# EAGLE design 514_lora_arduino_RAK811 (EAGLE 9.6.2)
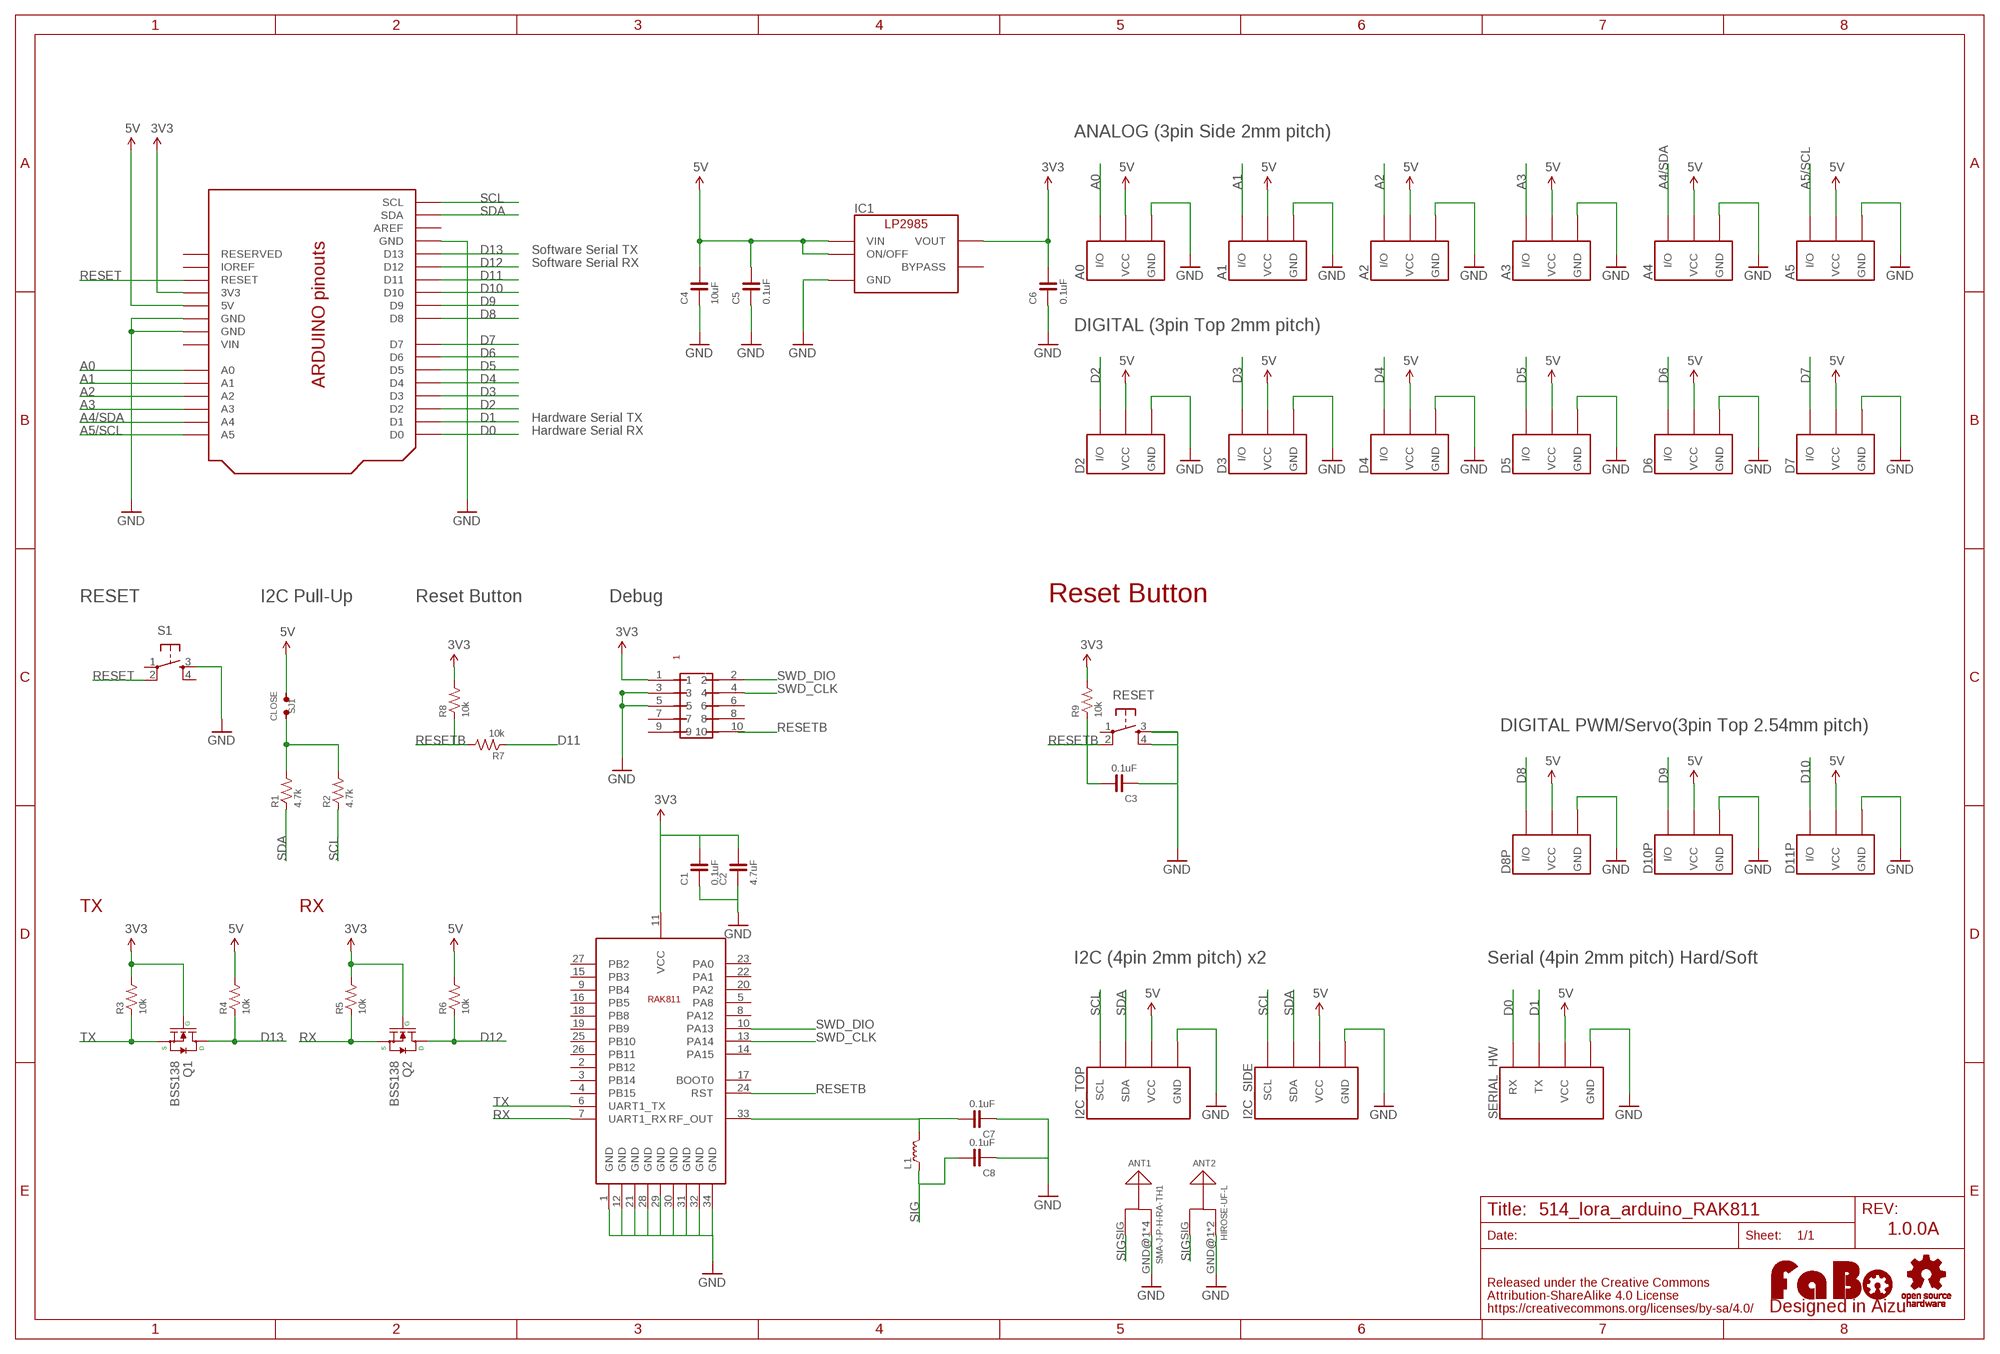
[diagram p0: schematic, sheet 1]

## Parts
A0  FABO_BRICK_3PIN-S03B-PASK-2_LONG  [FABO_BRICK_3PIN_S03B-PASK-2_LONG]
A1  FABO_BRICK_3PIN-S03B-PASK-2_LONG  [FABO_BRICK_3PIN_S03B-PASK-2_LONG]
A2  FABO_BRICK_3PIN-S03B-PASK-2_LONG  [FABO_BRICK_3PIN_S03B-PASK-2_LONG]
A3  FABO_BRICK_3PIN-S03B-PASK-2_LONG  [FABO_BRICK_3PIN_S03B-PASK-2_LONG]
A4  FABO_BRICK_3PIN-S03B-PASK-2_LONG  [FABO_BRICK_3PIN_S03B-PASK-2_LONG]
A5  FABO_BRICK_3PIN-S03B-PASK-2_LONG  [FABO_BRICK_3PIN_S03B-PASK-2_LONG]
ANT1  SMA-J-P-H-RA-TH1  ANTENA_SMA-J-P-H-RA-TH1  [SMA–J–P–H–RA–TH1]
ANT2  HIROSE-UF-L  ANTENA_HIROSE-UF-L  [HIROSE-UF-L]
C1  0.1uF  CAPACITOR-0603_NARROW  [0603-NARROW]
C2  4.7uF  CAPACITOR-0603_NARROW  [0603-NARROW]
C3  0.1uF  CAPACITOR-0603_NARROW  [0603-NARROW]
C4  10uF  CAPACITOR-0603_NARROW  [0603-NARROW]
C5  0.1uF  CAPACITOR-0603_NARROW  [0603-NARROW]
C6  0.1uF  CAPACITOR-0603_NARROW  [0603-NARROW]
C7  0.1uF  CAPACITOR-0603_NARROW  [0603-NARROW]
C8  0.1uF  CAPACITOR-0603_NARROW  [0603-NARROW]
D2  FABO_BRICK_3PIN-B03B-PASK-1  [FABO_BRICK_3PIN_B03B-PASK-1]
D3  FABO_BRICK_3PIN-B03B-PASK-1  [FABO_BRICK_3PIN_B03B-PASK-1]
D4  FABO_BRICK_3PIN-B03B-PASK-1  [FABO_BRICK_3PIN_B03B-PASK-1]
D5  FABO_BRICK_3PIN-B03B-PASK-1  [FABO_BRICK_3PIN_B03B-PASK-1]
D6  FABO_BRICK_3PIN-B03B-PASK-1  [FABO_BRICK_3PIN_B03B-PASK-1]
D7  FABO_BRICK_3PIN-B03B-PASK-1  [FABO_BRICK_3PIN_B03B-PASK-1]
D8P  FABO_BRICK_3PIN-HEADER  [FABO_BRICK_3PIN_HEADER]
D10P  FABO_BRICK_3PIN-HEADER  [FABO_BRICK_3PIN_HEADER]
D11P  FABO_BRICK_3PIN-HEADER  [FABO_BRICK_3PIN_HEADER]
I2C_SIDE  FABO_BRICK_I2C-S04B-PASK-2_LONG  [FABO_BRICK_I2C_S04B-PASK-2_LONG]
I2C_TOP  FABO_BRICK_I2C-B04B-PASK-1  [FABO_BRICK_I2C_B04B-PASK-1]
IC1  LP2985-33DBV  [SOT-23-5]
L1  COIL-0603  [0603]
LOGO1  LOGO_FABO-M  [LOGO_FABO_M]
Q1  BSS138  MOSFET-N  [SOT23-3]
Q2  BSS138  MOSFET-N  [SOT23-3]
R1  4.7k  RESISTOR-0603  [0603]
R2  4.7k  RESISTOR-0603  [0603]
R3  10k  RESISTOR-0603-NARROW  [0603-NARROW]
R4  10k  RESISTOR-0603-NARROW  [0603-NARROW]
R5  10k  RESISTOR-0603-NARROW  [0603-NARROW]
R6  10k  RESISTOR-0603-NARROW  [0603-NARROW]
R7  10k  RESISTOR-0603-NARROW  [0603-NARROW]
R8  10k  RESISTOR-0603-NARROW  [0603-NARROW]
R9  10k  RESISTOR-0603-NARROW  [0603-NARROW]
RESET  TACT-SWITCH-SMD_KMR2  [KMR2]
S1  TACT-SWITCH-6MM  [DTS_6_V]
SERIAL_HW  FABO_BRICK_SERIAL-B04B-PASK-1  [FABO_BRICK_SERIAL_B04B-PASK-1]
SJ1  CLOSE  SMD-JUMPER-2-0603  [SMD-JUMPER-0603]
U1  ARDUINO_UNO_R3_SHIELD-OUTIN  [ARDUINO_SHIELD_OUTIN]
U$3  RAK811  [RAK811]
U$4  LOGO_OSHW-M_BOTTOM  [LOGO_OSHW_M_BOTTOM]
U$15  PIN-HEADER-SMT(1.27MM)2X5  [PIN-HEADER-SMT(1.27MM)2X5]

## Nets
3V3: C1.2 C2.2 C6.2 IC1.5(VOUT) Q1.1(G) Q2.1(G) R3.2 R5.2 R8.2 R9.2 U1.3V3 U$3.11(VCC) U$15.1
5V: A0.VCC A1.VCC A2.VCC A3.VCC A4.VCC A5.VCC C4.2 C5.2 D2.VCC D3.VCC D4.VCC D5.VCC D6.VCC D7.VCC D8P.VCC D10P.VCC D11P.VCC I2C_SIDE.VCC I2C_TOP.VCC IC1.1(VIN) IC1.3(ON/OFF) R4.2 R6.2 SERIAL_HW.VCC SJ1.1 U1.5V
A0: A0.I/O U1.A0
A1: A1.I/O U1.A1
A2: A2.I/O U1.A2
A3: A3.I/O U1.A3
A4/SDA: A4.I/O U1.A4
A5/SCL: A5.I/O U1.A5
D0: SERIAL_HW.RX U1.D0
D1: SERIAL_HW.TX U1.D1
D2: D2.I/O U1.D2
D3: D3.I/O U1.D3
D4: D4.I/O U1.D4
D5: D5.I/O U1.D5
D6: D6.I/O U1.D6
D7: D7.I/O U1.D7
D8: D8P.I/O U1.D8
D9: D10P.I/O U1.D9
D10: D11P.I/O U1.D10
D11: R7.1 U1.D11
D12: Q2.3(D) R6.1 U1.D12
D13: Q1.3(D) R4.1 U1.D13
GND: A0.GND A1.GND A2.GND A3.GND A4.GND A5.GND ANT1.GND@1(GND) ANT1.GND@2(GND) ANT1.GND@3(GND) ANT1.GND@4(GND) ANT2.GND@1(GND) ANT2.GND@2(GND) C1.1 C2.1 C3.1 C4.1 C5.1 C6.1 C7.1 C8.1 D2.GND D3.GND D4.GND D5.GND D6.GND D7.GND D8P.GND D10P.GND D11P.GND I2C_SIDE.GND I2C_TOP.GND IC1.2(GND) RESET.3 RESET.4 S1.3 SERIAL_HW.GND U1.GND1(GND) U1.GND2(GND) U1.GND3(GND) U$3.1(GND) U$3.12(GND) U$3.21(GND) U$3.28(GND) U$3.30(GND) U$3.31(GND) U$3.32(GND) U$3.34(GND) U$15.3 U$15.5
N$1: R1.2 R2.2 SJ1.2
N$2: C7.2 L1.2 U$3.33(RF_OUT)
RESET: S1.2 U1.RESET
RESETB: C3.2 R7.2 R8.1 R9.1 RESET.2 U$3.24(RST) U$15.10
RX: Q2.2(S) R5.1 U$3.7(UART1_RX)
SCL: I2C_SIDE.SCL I2C_TOP.SCL R2.1 U1.SCL
SDA: I2C_SIDE.SDA I2C_TOP.SDA R1.1 U1.SDA
SIG: ANT1.SIG ANT2.SIG C8.2 L1.1
SWD_CLK: U$3.13(PA14) U$15.4
SWD_DIO: U$3.10(PA13) U$15.2
TX: Q1.2(S) R3.1 U$3.6(UART1_TX)
Unconnected: IC1.4(BYPASS) RESET.1 S1.1 S1.4 U1.AREF U1.IOREF U1.RESERVED U$3.2(PB12) U$3.3(PB14) U$3.4(PB15) U$3.5(PA8) U$3.8(PA12) U$3.9(PB4) U$3.14(PA15) U$3.15(PB3) U$3.16(PB5) U$3.17(BOOT0) U$3.18(PB8) U$3.19(PB9) U$3.20(PA2) U$3.22(PA1) U$3.23(PA0) U$3.25(PB10) U$3.26(PB11) U$3.27(PB2) U$3.29(GND) U$15.6 U$15.7 U$15.8 U$15.9

## Notes on the sheet
- ANALOG (3pin Side 2mm pitch)
- Software Serial TX
- Software Serial RX
- DIGITAL (3pin Top 2mm pitch)
- Hardware Serial TX
- Hardware Serial RX
- RESET | I2C Pull-Up | Reset Button | Debug | Reset Button
- DIGITAL PWM/Servo(3pin Top 2.54mm pitch)
- TX | RX
- I2C (4pin 2mm pitch) x2 | Serial (4pin 2mm pitch) Hard/Soft
- 1.0.0A

## Power pins joined to a net without a drawn wire
VIN: U1.VIN

## Library data of the parts
A0 A1-A5 D2-D7 D8P D10P D11P = FaBo-Template:FABO_BRICK_3PIN: FaBo Brick 3pin
ANT1 ANT2 = FaBo-Antena:ANTENA
C1-C8 = FaBo-Capacitor:CAPACITOR: CAPACITOR
I2C_SIDE I2C_TOP = FaBo-Template:FABO_BRICK_I2C: FaBo Brick I2C
IC1 = FaBo-Supply:LP2985: LP2985
L1 = FaBo-Coil:COIL: RESISTOR
LOGO1 = component:LOGO_FABO
Q1 Q2 = FaBo-etc:MOSFET-N
R1-R9 = FaBo-Resistors:RESISTOR: RESISTOR
RESET S1 = FaBo-Switch:TACT-SWITCH
SERIAL_HW = FaBo-Template:FABO_BRICK_SERIAL: FaBo Brick Serial
SJ1 = FaBo-Supply:SMD-JUMPER-2
U1 = FaBo-Boards:ARDUINO_UNO_R3_SHIELD
U$3 = FaBo-LoRa:RAK811
U$4 = component:LOGO_OSHW
U$15 = GClue:PIN-HEADER-SMT(1.27MM)2X5: PIN-HEADER-SMT (1.27MM) 2x5

## Board
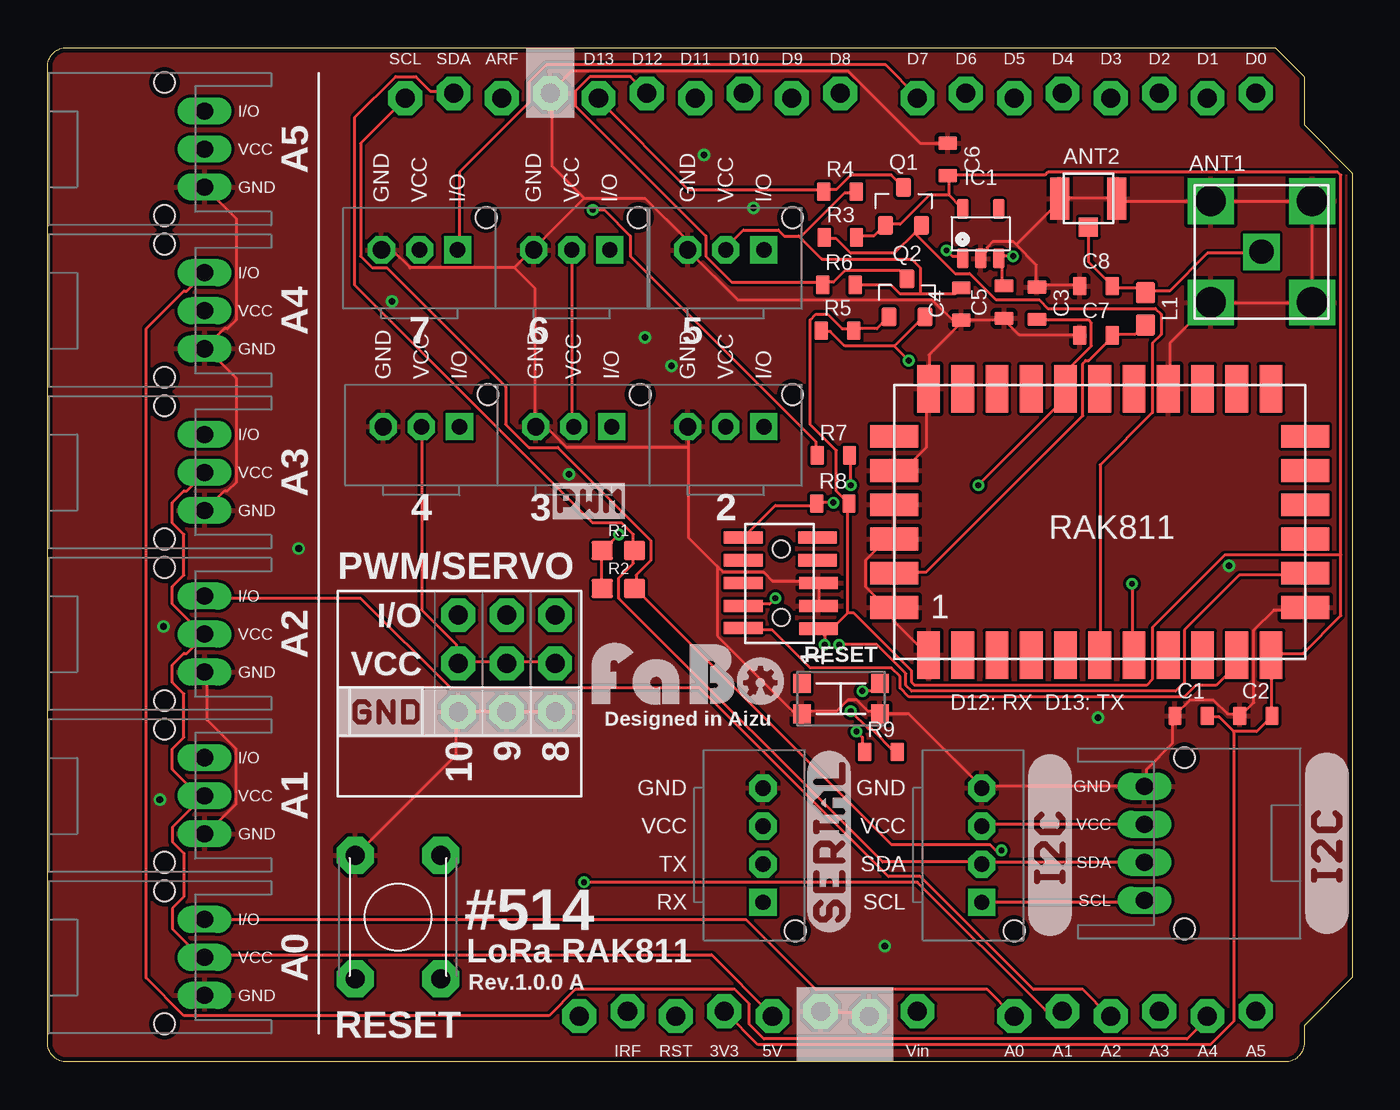
[diagram p1: board, top side]
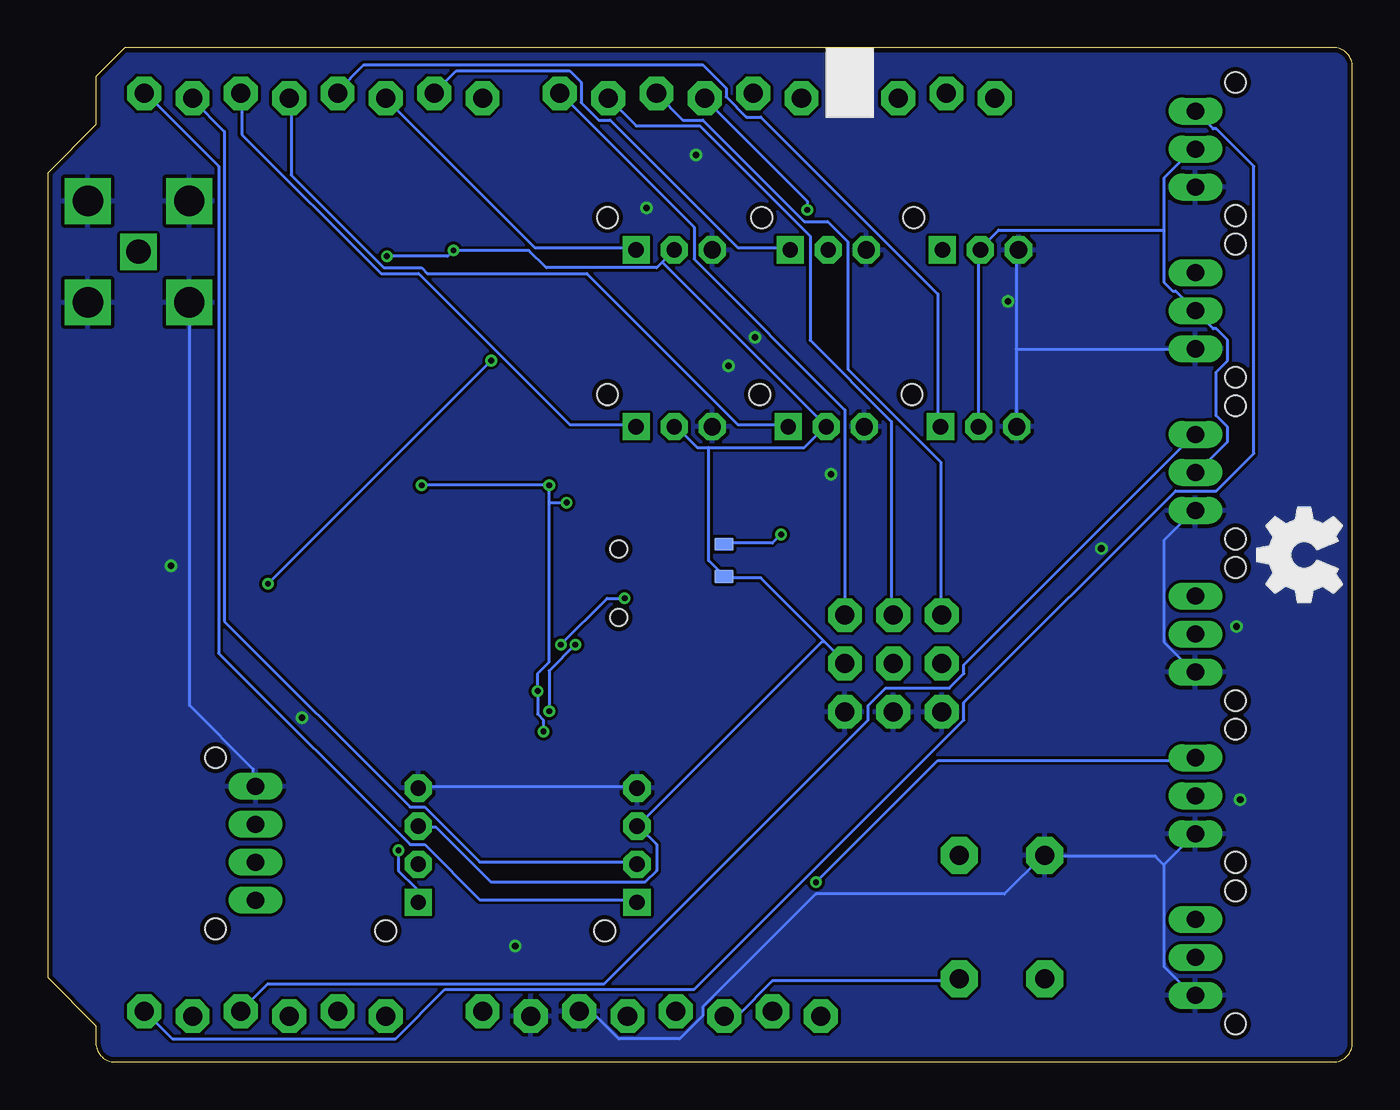
[diagram p2: board, bottom side, seen from below]

Size 68.58 x 53.34 mm. Coordinates in mm from the lower left corner, seen from the top.
Copper layers (1*16): Top 0.035mm / dielectric 1.6mm / Bottom 0.035mm
Design rules "PCBway": minimum track width 6mil, minimum drill 12mil, track to track 6mil, track to pad 6mil, pad to pad 6mil, via to via 6mil, smd to smd 6mil, copper to edge 10mil, drill to drill 10mil, minimum pad ring 10mil, minimum via ring 6mil, stop-mask expansion 2mil, vias tented up to drill 100mil, thermal gap 8mil

### Footprints (pad centres in the part's own frame; a part is rotated, then mirrored left to right if it is on the bottom)
FABO_BRICK_3PIN_S03B-PASK-2_LONG = drill 0.9 pad 1.422 long: GND -2,0; I/O 2,0; VCC 0,0 | hole 1.1: 3.5,2.1; -3.5,2.1
SMA–J–P–H–RA–TH1 = drill 1.6 square: GND@1 -2.665,2.665; GND@2 2.665,2.665; GND@3 -2.665,-2.665; GND@4 2.665,-2.665 | drill 1.27 square: SIG 0,0
HIROSE-UF-L = smd 1 x 2.2: GND@1 -1.5,0; GND@2 1.5,0 | smd 1 x 1: SIG 0,-1.5
0603-NARROW = smd 0.71 x 1: 1 -0.85,0; 2 0.85,0
FABO_BRICK_3PIN_B03B-PASK-1 = drill 0.9 pad 1.422 octagon: GND -2,0 | drill 0.8 pad 1.422 square: I/O 2,0 | drill 0.8 pad 1.422 octagon: VCC 0,0 | hole 1.1: 3.5,1.7
FABO_BRICK_3PIN_HEADER = drill 1 pad 1.778 octagon: GND -2.54,0; I/O 2.54,0; VCC 0,0
FABO_BRICK_I2C_S04B-PASK-2_LONG = drill 0.9 pad 1.422 long: GND -3,0; SCL 3,0; SDA 1,0; VCC -1,0 | hole 1.1: 4.5,2.1; -4.5,2.1
FABO_BRICK_I2C_B04B-PASK-1 = drill 0.8 pad 1.422 octagon: GND -3,0; SDA 1,0; VCC -1,0 | drill 0.8 pad 1.422 square: SCL 3,0 | hole 1.1: 4.5,1.7
SOT-23-5 = smd 0.6 x 1.05: 1 -0.95,-1.3; 2 0,-1.3; 3 0.95,-1.3; 4 0.95,1.3; 5 -0.95,1.3
0603 = smd 1.1 x 1: 1 -0.85,0; 2 0.85,0
SOT23-3 = smd 0.8 x 1: 1 -0.95,-1; 2 0.95,-1; 3 0,1
KMR2 = smd 0.9 x 1: 1 -2.05,0.8; 2 2.05,0.8; 3 2.05,-0.8; 4 -2.05,-0.8
DTS_6_V = drill 1 pad 1.93 octagon: 1 -3.25,2.25; 2 3.25,2.25; 3 -3.25,-2.25; 4 3.25,-2.25
FABO_BRICK_SERIAL_B04B-PASK-1 = drill 0.8 pad 1.422 octagon: GND -3,0; TX 1,0; VCC -1,0 | drill 0.8 pad 1.422 square: RX 3,0 | hole 1.1: 4.5,1.7
SMD-JUMPER-0603 = smd 0.71 x 1: 1 -0.85,0; 2 0.85,0
ARDUINO_SHIELD_OUTIN = drill 1 pad 1.778 octagon: 3V3 35.56,2.667; 5V 38.1,2.413; A0 50.8,2.413; A1 53.34,2.667; A2 55.88,2.413; A3 58.42,2.667; A4 60.96,2.413; A5 63.5,2.667; AREF 23.876,50.673; D0 63.5,50.927; D1 60.96,50.673; D2 58.42,50.927; D3 55.88,50.673; D4 53.34,50.927; D5 50.8,50.673; D6 48.26,50.927; D7 45.72,50.673; D8 41.656,50.927; D9 39.116,50.673; D10 36.576,50.927; D11 34.036,50.673; D12 31.496,50.927; D13 28.956,50.673; GND1 43.18,2.413; GND2 40.64,2.667; GND3 26.416,50.927; IOREF 30.48,2.667; RESERVED 27.94,2.413; RESET 33.02,2.413; SCL 18.796,50.673; SDA 21.336,50.927; VIN 45.72,2.667
RAK811 = smd 1.2 x 2.5: 1 -9,-7; 2 -7.2,-7; 3 -5.4,-7; 4 -3.6,-7; 5 -1.8,-7; 6 0,-7; 7 1.8,-7; 8 3.6,-7; 9 5.4,-7; 10 7.2,-7; 11 9,-7; 18 9,7; 19 7.2,7; 20 5.4,7; 21 3.6,7; 22 1.8,7; 23 0,7; 24 -1.8,7; 25 -3.6,7; 26 -5.4,7; 27 -7.2,7; 28 -9,7 | smd 2.5 x 1.2: 12 10.8,-4.5; 13 10.8,-2.7; 14 10.8,-0.9; 15 10.8,0.9; 16 10.8,2.7; 17 10.8,4.5; 29 -10.8,4.5; 30 -10.8,2.7; 31 -10.8,0.9; 32 -10.8,-0.9; 33 -10.8,-2.7; 34 -10.8,-4.5
PIN-HEADER-SMT(1.27MM)2X5 = smd 0.635 x 2.032: 1 -2.4,-1.95; 2 -2.35,2; 3 -1.2,-1.95; 4 -1.2,2; 5 0,-1.95; 6 0,2; 7 1.2,-1.9; 8 1.2,2; 9 2.4,-1.9; 10 2.4,2 | hole 0.9: 1.8,0; -1.8,0

### Placement (x,y rotation side)
A0  8.25,5.5 90 top
A1  8.25,14 90 top
A2  8.25,22.5 90 top
A3  8.25,31 90 top
A4  8.25,39.5 90 top
A5  8.25,48 90 top
ANT1  63.8,42.6 0 top
ANT2  54.7,45.4 0 top
C1  60.1,18.2 0 top
C2  63.5,18.2 0 top
C3  52,39.9 270 top
C4  48.02,39.85 90 top
C5  50.27,39.95 90 top
C6  47.31,47.45 270 top
C7  55.1,38.2 0 top
C8  55.1,40.8 0 top
D2  35.65,33.4 0 top
D3  27.65,33.4 0 top
D4  19.65,33.4 0 top
D5  35.65,42.7 0 top
D6  27.55,42.7 0 top
D7  19.55,42.7 0 top
D8P  26.67,20.95 90 top
D10P  24.13,20.95 90 top
D11P  21.59,20.95 90 top
I2C_SIDE  57.65,11.5 270 top
I2C_TOP  49.1,11.4 270 top
IC1  49.04,43.55 0 top
L1  57.7,39.6 270 top
LOGO1  33.66,18.41 0 top
Q1  44.98,44.98 0 top
Q2  45.16,40.19 0 top
R1  30,26.9 180 top
R2  30,24.9 180 top
R3  41.67,43.36 0 top
R4  41.65,45.76 0 top
R5  41.52,38.46 0 top
R6  41.59,40.86 0 top
R7  41.3,31.9 0 top
R8  41.27,29.36 0 top
R9  43.8,16.3 0 top
RESET  41.7,19.1 0 top
S1  18.41,7.62 270 top
SERIAL_HW  37.6,11.4 270 top
SJ1  33.03,26.37 90 bottom
U1  0,0 0 top
U$2  [LOGO_SILK_SERIAL2]  42.25,11.6 90 top
U$3  55.3,28.4 0 top
U$4  2.54,26.67 270 top
U$5  [LOGO_SILK_PWM]  26.55,28.55 0 top
U$11  [LOGO_SILK_I2C]  68.4,11.5 90 top
U$12  [LOGO_SILK_I2C]  53.85,11.4 90 top
U$15  38.56,25.18 90 top
U$19  [LOGO_SILK_GND]  15.88,17.14 0 top

### Tracks (layer width: path | path; a pad name or v marks a point on that pad's centre or on a via)
3V3  (via drill 0.3)
  Top 0.152: Q2.1 44.2,39.17 43.59,38.56 42.52,38.56 R5.2 42.37,38.56 41.76,38.56 41,39.32 40.39,39.32 40.08,39.01 40.08,33.53 41.45,32.16 41.45,30.02 42.06,29.41 R8.2 42.06,29.26 42.06,23.62 | v42.22,18.44 43.13,17.53 43.28,17.53 44.5,16.31 R9.2 | 40.84,22.4 v40.84,21.95 | 40.84,22.4 40.54,22.71 U$15.1 | 40.84,22.4 42.06,23.62 | R3.2 42.67,43.43 43.43,43.43 43.89,43.89 Q1.1 44.04,44.04 44.81,44.04 46.33,45.57 47.4,45.57 | 47.4,45.57 47.4,46.48 C6.2 47.4,46.63 52.43,46.63 52.58,46.79 67.82,46.79 67.97,46.63 67.97,26.67 | 47.4,45.57 48.01,44.96 IC1.5 | 62.33,17.37 61.57,18.14 60.96,18.14 C1.2 | 62.33,17.37 63.55,17.37 64.31,18.14 C2.2 64.31,18.29 64.31,21.34 U$3.11 64.31,21.49 65.99,21.49 67.97,23.47 67.97,26.67 | 62.33,17.37 62.33,2.13 61.11,0.91 37.34,0.91 35.66,2.59 U1.3V3 | 42.06,23.62 42.37,23.62 45.41,20.57 45.41,19.96 45.57,19.81 57.76,19.81 58.06,20.12 58.06,22.86 61.87,26.67 67.97,26.67
  Bottom 0.152: v42.22,18.44 42.22,20.57 v40.84,21.95
5V  (via drill 0.3)
  Top 0.152: 45.87,40.39 47.7,40.39 48.01,40.69 C4.2 | 45.87,40.39 44.81,40.39 44.35,40.84 42.52,40.84 R6.2 | C5.2 50.14,40.84 50.14,42.22 IC1.3 50.14,42.37 v50.75,42.37 | 39.47,43.43 38.71,43.43 38.41,43.74 36.58,43.74 35.66,42.82 D5.VCC | 39.47,43.43 39.62,43.43 41.91,45.72 42.37,45.72 R4.2 | v47.24,42.67 47.55,42.37 48.01,42.37 IC1.1 | 45.87,40.39 45.87,41.76 45.41,42.22 40.69,42.22 39.47,43.43 | D6.VCC 27.58,42.67 27.58,33.53 D3.VCC | I2C_TOP.VCC 49.23,12.5 57.61,12.5 I2C_SIDE.VCC | D8P.VCC 26.67,21.03 24.23,21.03 D10P.VCC 24.08,21.03 21.64,21.03 D11P.VCC 21.49,21.03 21.49,21.95 19.66,23.77 19.66,33.38 D4.VCC | 8.08,13.87 8.23,14.02 A1.VCC 8.08,13.87 | 8.08,13.87 6.55,12.34 6.55,11.58 7.16,10.97 7.16,8.69 6.55,8.08 6.55,7.01 7.92,5.64 8.23,5.64 A0.VCC 8.38,5.64 34.9,5.64 38.1,2.44 U1.5V | 8.23,22.4 7.32,21.49 7.16,21.49 6.55,20.88 6.55,19.96 7.16,19.36 7.16,17.07 6.55,16.46 6.55,15.39 8.08,13.87 | 8.23,22.4 6.55,24.08 6.55,24.99 7.16,25.6 7.16,27.74 6.55,28.35 6.55,29.41 7.16,30.02 7.32,30.02 8.23,30.94 A3.VCC | 8.23,22.4 A2.VCC
  Bottom 0.152: 36.27,42.06 35.66,42.67 D5.VCC | 36.27,42.06 36.58,41.76 42.37,41.76 43.28,42.67 v47.24,42.67 47.55,42.37 v50.75,42.37 | 33.83,32.31 34.44,32.31 35.51,33.38 D2.VCC | 33.83,32.31 28.8,32.31 27.74,33.38 D3.VCC 27.74,33.53 36.27,42.06 | 27.74,22.1 26.67,21.03 D8P.VCC | 27.74,22.1 31.09,25.45 32.92,25.45 SJ1.1 33.07,25.6 33.83,26.36 33.83,32.31 | 27.74,22.1 27.89,22.1 37.49,12.5 SERIAL_HW.VCC 37.49,12.34 36.58,11.43 36.58,10.06 37.19,9.45 45.26,9.45 48.16,12.34 49.07,12.34 I2C_TOP.VCC | 9.91,43.74 9.91,46.48 8.38,48.01 A5.VCC | 9.91,43.74 9.91,41 9.45,40.54 9.3,40.54 8.38,39.62 A4.VCC 8.23,39.47 7.32,38.56 7.16,38.56 6.55,37.95 6.55,36.88 7.16,36.27 7.16,33.98 6.55,33.38 6.55,32.61 8.23,30.94 A3.VCC | D4.VCC 19.66,33.53 19.66,42.67 D7.VCC 19.51,42.82 18.59,43.74 9.91,43.74
A0
  Top 0.152: A0.I/O 8.38,7.47 36.73,7.47 40.39,3.81 49.38,3.81 50.75,2.44 U1.A0
A1  (via drill 0.3)
  Top 0.152: v28.19,9.45 45.72,9.45 52.43,2.74 53.34,2.74 U1.A1
  Bottom 0.152: v28.19,9.45 21.79,15.85 8.38,15.85 A1.I/O
A2
  Top 0.152: A2.I/O 8.38,24.38 16.46,24.38 21.18,19.66 34.29,19.66 44.2,9.75 45.87,9.75 51.82,3.81 54.41,3.81 55.78,2.44 U1.A2
A3
  Bottom 0.152: A3.I/O 8.38,32.92 20.42,20.88 20.42,20.42 21.18,19.66 24.54,19.66 25.45,18.75 25.45,17.98 39.32,4.12 57,4.12 58.37,2.74 U1.A3
A4/SDA
  Top 0.152: A4.I/O 8.23,41.45 7.32,40.54 7.16,40.54 5.18,38.56 5.18,4.42 7.16,2.44 26.36,2.44 27.74,3.81 36.12,3.81 36.88,3.05 36.88,1.98 37.64,1.22 59.89,1.22 60.96,2.29 U1.A4
A5/SCL
  Bottom 0.152: A5.I/O 8.23,49.99 7.32,49.07 7.16,49.07 5.18,47.09 5.18,32 7.16,30.02 9.3,30.02 20.42,18.9 20.42,17.98 34.59,3.81 47.7,3.81 50.29,1.22 62.03,1.22 63.4,2.59 U1.A5
D0
  Bottom 0.152: SERIAL_HW.RX 37.64,8.53 45.87,8.53 48.77,11.43 49.53,11.43 59.59,21.49 59.59,47.09 63.4,50.9 U1.D0
D1
  Bottom 0.152: SERIAL_HW.TX 37.64,10.52 45.87,10.52 48.77,13.41 49.53,13.41 59.28,23.16 59.28,48.92 60.96,50.6 U1.D1
D2
  Bottom 0.152: D2.I/O 37.8,33.53 41.15,33.53 49.07,41.45 51.05,41.45 58.37,48.77 58.37,50.9 U1.D2
D3
  Bottom 0.152: D3.I/O 29.72,33.53 32.31,33.53 40.23,41.45 48.62,41.45 48.92,41.76 50.9,41.76 55.78,46.63 55.78,50.6 U1.D3
D4
  Bottom 0.152: D4.I/O 21.79,33.53 21.79,40.39 31.09,49.68 31.85,49.68 32.92,50.75 32.92,51.21 34.14,52.43 51.97,52.43 53.34,51.05 U1.D4
D5
  Bottom 0.152: D5.I/O 37.8,42.82 42.98,42.82 50.75,50.6 U1.D5
D6
  Bottom 0.152: D6.I/O 29.57,42.82 32.31,42.82 39.01,49.53 39.62,49.53 40.54,50.44 40.54,51.51 41.15,52.12 47.09,52.12 48.16,51.05 U1.D6
D7
  Top 0.152: D7.I/O 21.64,42.82 21.64,46.79 25.3,50.44 25.3,51.51 26.21,52.43 44.04,52.43 45.72,50.75 U1.D7
D8
  Bottom 0.152: D8P.I/O 26.67,34.29 34.59,42.22 34.59,43.89 41.6,50.9 U1.D8
D9
  Bottom 0.152: D10P.I/O 24.23,23.62 24.23,33.68 28.5,37.95 28.5,43.43 34.29,49.23 37.64,49.23 39.01,50.6 U1.D9
D10
  Bottom 0.152: D11P.I/O 21.64,23.62 21.64,31.55 26.52,36.42 26.52,43.13 27.58,44.2 28.8,44.2 34.14,49.53 35.2,49.53 36.58,50.9 U1.D10
D11  (via drill 0.3)
  Top 0.152: v28.65,44.81 29.26,44.81 30.63,43.43 30.63,42.37 40.39,32.61 40.39,32 R7.1
  Bottom 0.152: v28.65,44.81 28.65,45.26 33.98,50.6 U1.D11
D12
  Top 0.152: Q2.3 45.11,41.3 44.81,41.6 41.91,41.6 41.3,41 40.84,41 R6.1 40.69,41 35.97,41 34.59,42.37 34.59,43.43 27.74,50.29 27.74,51.05 28.5,51.82 30.63,51.82 31.39,51.05 U1.D12
D13
  Top 0.152: Q1.3 44.96,46.02 44.35,46.63 42.22,46.63 41.45,45.87 40.84,45.87 R4.1 40.69,45.87 33.68,45.87 28.96,50.6 U1.D13
GND  (via drill 0.35)
  Top 0.152: U$3.21 58.98,35.51 58.98,37.8 61.11,39.93 ANT1.GND@3 61.27,39.93 66.45,39.93 ANT1.GND@4 66.45,40.08 66.45,45.26 | C8.1 54.1,40.84 52.12,40.84 C3.1 51.97,40.84 51.97,41.91 50.9,42.98 | 50.9,42.98 50.75,43.13 49.68,43.13 49.38,42.82 49.38,42.67 49.07,42.37 IC1.2 | 50.9,42.98 53.19,45.26 ANT2.GND@1 53.34,45.41 56.08,45.41 ANT2.GND@2 56.24,45.26 61.11,45.26 ANT1.GND@1 61.27,45.26 66.45,45.26 | 66.45,45.26 ANT1.GND@2 | U$3.12 65.99,23.77 64.47,23.77 63.4,22.71 63.4,18.9 62.79,18.29 C2.1 62.64,18.29 62.03,18.29 61.27,19.05 60.05,19.05 59.28,18.29 C1.1 59.13,18.14 59.13,16.76 57.76,15.39 57.76,14.63 I2C_SIDE.GND 57.61,14.48 49.23,14.48 I2C_TOP.GND 49.07,14.48 45.26,18.29 43.89,18.29 RESET.3 43.74,18.44 43.13,18.44 42.52,19.05 42.06,19.05 41.45,18.44 39.78,18.44 RESET.4 39.62,18.44 39.17,18.44 35.2,22.4 35.2,26.06 | D8P.GND 26.67,18.44 24.23,18.44 D10P.GND 24.08,18.44 21.64,18.44 D11P.GND 21.49,18.29 21.49,16.15 16.31,10.97 S1.3 | U1.GND2 40.69,2.59 42.98,2.59 43.13,2.44 U1.GND1 | A2.GND 8.38,20.42 8.38,17.98 9.91,16.46 9.91,13.56 8.38,12.04 A1.GND | U$3.1 46.18,21.49 44.5,23.16 44.5,23.77 U$3.34 44.35,23.93 44.04,23.93 42.98,24.99 42.98,26.36 44.04,27.43 44.35,27.43 U$3.32 44.5,27.58 44.5,29.26 U$3.31 44.5,29.41 U$3.30 44.5,31.24 45.11,31.24 46.18,32.31 46.18,35.36 U$3.28 46.33,35.51 46.33,37.19 47.85,38.71 | C4.1 48.16,39.01 50.14,39.01 C5.1 50.29,39.01 51.05,38.25 54.1,38.25 C7.1 | 47.85,38.71 48.01,38.86 C4.1 | U$15.3 40.54,24.08 40.54,25.15 U$15.5 40.39,25.3 38.1,25.3 37.64,25.76 35.51,25.76 35.2,26.06 | 35.2,26.06 33.68,27.58 33.68,32.31
  Top 0.152: 33.68,32.31 33.68,33.38 D2.GND | 33.68,32.31 27.28,32.31 26.21,33.38 25.76,33.38 D3.GND 25.6,33.53 25.6,40.69 24.54,41.76 | C6.1 47.24,48.31 45.87,48.31 42.06,52.12 27.58,52.12 26.52,51.05 U1.GND3 26.52,50.9 26.52,47.09 28.19,45.41 | A5.GND 8.38,45.87 9.91,44.35 9.91,39.01 9.45,38.56 9.3,38.56 8.38,37.64 A4.GND 8.38,37.49 9.91,35.97 9.91,30.48 9.45,30.02 9.3,30.02 8.38,29.11 A3.GND | 24.54,41.76 19.05,41.76 18.14,42.67 17.68,42.67 D7.GND | 24.54,41.76 25.45,42.67 D6.GND 25.6,42.82 28.19,45.41 | 28.19,45.41 31.39,45.41 33.53,43.28 33.53,42.82 D5.GND 33.68,42.67 36.27,40.08 46.48,40.08 47.85,38.71 | 47.85,38.71 C4.1
  Bottom 0.152: SERIAL_HW.GND 37.64,14.48 49.07,14.48 I2C_TOP.GND | ANT1.GND@3 61.11,39.93 61.11,18.75 57.76,15.39 57.76,14.63 I2C_SIDE.GND | A2.GND 8.38,20.57 9.91,22.1 9.91,27.43 8.38,28.96 A3.GND | 9.91,10.36 9.91,5.03 8.38,3.5 A0.GND | 9.91,10.36 8.38,11.89 A1.GND | 9.91,10.36 10.36,10.82 16.15,10.82 S1.3 16.31,10.82 18.29,8.84 28.19,8.84 34.14,2.9 34.14,2.44 35.36,1.22 38.56,1.22 39.93,2.59 40.54,2.59 U1.GND2 | 17.68,37.49 17.68,42.67 D7.GND | 17.68,37.49 17.68,33.53 D4.GND | 17.68,37.49 8.38,37.49 A4.GND
  other vias: 6.1,22.9 5.9,13.8 13.2,27 44,6.1 18.1,40 34.5,47.7 32.8,36.6 37.1,44.9 62.1,26.1 55.2,18.1 27.4,30.9 31.4,38.1
  pour Bottom: 0,0 0,53.34 68.58,53.34 68.58,0
  pour Top: 0,0 0,53.34 68.58,53.34 68.58,0
N$1  (via drill 0.3)
  Top 0.152: v30.02,27.74 29.26,26.98 R1.2 29.11,26.82 29.11,24.99 R2.2
  Bottom 0.152: v30.02,27.74 30.48,27.28 32.92,27.28 SJ1.2
N$2
  Top 0.152: L1.2 57.61,38.71 57.15,38.25 56.08,38.25 C7.2 55.93,38.1 54.71,36.88 54.56,36.88 54.41,36.73 54.41,33.98 46.18,25.76 44.5,25.76 U$3.33
RESET
  Bottom 0.152: U1.RESET 32.92,2.44 32.31,2.44 30.48,4.27 20.73,4.27 S1.2
RESETB  (via drill 0.3)
  Top 0.152: C3.2 52.12,39.01 54.71,39.01 54.86,38.86 54.86,37.64 53.65,36.42 53.65,35.51 U$3.24 53.49,35.36 53.49,34.9 v48.92,30.33 | U$15.10 36.58,27.58 38.25,29.26 40.39,29.26 R8.1 40.54,29.41 v41.3,29.41 | v42.52,17.37 42.82,17.07 42.82,16.31 R9.1 | v42.82,19.51 43.43,19.51 43.74,19.81 RESET.2 | v42.22,30.33 42.22,31.85 R7.2
  Bottom 0.152: v42.52,17.37 42.52,17.98 42.82,18.29 v42.82,19.51 42.82,20.42 42.22,21.03 42.22,29.41 | 42.22,29.41 v42.22,30.33 v48.92,30.33 | 42.22,29.41 v41.3,29.41
RX  (via drill 0.3)
  Top 0.152: 44.5,37.64 41.91,37.64 41.15,38.41 40.69,38.41 R5.1 | 44.5,37.64 46.02,39.17 Q2.2 | v57,25.15 57,21.49 U$3.7 | 44.5,37.64 v45.26,36.88
  Bottom 0.152: v45.26,36.88 v57,25.15
SCL  (via drill 0.3)
  Top 0.152: I2C_TOP.SCL 49.23,8.38 57.61,8.38 I2C_SIDE.SCL | U1.SCL 18.75,50.6 16.46,48.31 16.46,42.37 17.07,41.76 17.83,41.76 24.08,35.51 24.08,33.53 25.3,32.31 26.82,32.31 31.7,27.43 31.7,26.36 30.94,25.6 30.94,24.99 R2.1 30.94,24.84 44.35,11.43 49.53,11.43 49.84,11.12 v50.14,11.12
  Bottom 0.152: v50.14,11.12 50.14,10.06 49.23,9.14 49.23,8.53 I2C_TOP.SCL
SDA
  Top 0.152: I2C_SIDE.SDA 57.61,10.52 49.23,10.52 I2C_TOP.SDA 49.07,10.52 43.89,10.52 30.02,24.38 30.02,25.45 30.79,26.21 30.79,26.82 R1.1 30.79,26.98 30.79,27.74 30.18,28.35 28.65,28.35 16.15,40.84 16.15,49.68 18.29,51.82 19.36,51.82 20.12,51.05 21.34,51.05 U1.SDA
SIG
  Top 0.152: ANT2.SIG 54.71,43.89 54.71,42.06 55.93,40.84 C8.2 56.08,40.69 57.45,40.69 57.61,40.54 L1.1 57.76,40.54 58.98,40.54 60.96,42.52 63.7,42.52 ANT1.SIG
SWD_CLK  (via drill 0.3)
  Top 0.152: v38.25,24.38 37.95,24.08 36.58,24.08 U$15.4 | v41.6,21.95 43.59,21.95 45.11,20.42 45.11,19.81 45.41,19.51 59.28,19.51 59.74,19.96 59.74,22.71 62.64,25.6 65.99,25.6 U$3.13
  Bottom 0.152: v38.25,24.38 39.17,24.38 v41.6,21.95
SWD_DIO
  Top 0.152: U$15.2 36.58,22.71 38.1,22.71 40.08,20.73 44.35,20.73 44.81,20.27 44.81,19.66 45.26,19.2 59.74,19.2 60.35,19.81 61.42,19.81 62.48,20.88 62.48,21.34 U$3.10
TX
  Top 0.152: 45.57,43.59 45.87,43.89 Q1.2 45.57,43.59 | 45.57,43.59 44.5,42.52 42.22,42.52 41.45,43.28 40.84,43.28 R3.1 | 45.57,43.59 47.7,41.45 48.46,41.45 49.84,40.08 52.12,40.08 52.58,39.62 58.22,39.62 58.52,39.32 58.52,38.25 58.06,37.8 58.06,34.14 55.32,31.39 55.32,21.49 U$3.6

### Text on the board
tPlace: SCL | SDA | ARF | D13 | D12 | D11 | D10 | D9 | D8 | D7 | D6 | D5 | D4 | D3 | D2 | D1 | D0 | I/O | VCC | GND | GND | VCC | I/O | GND | VCC | I/O | GND | VCC | I/O | I/O | VCC | 7 | 6 | 5 | GND | GND | VCC | I/O | GND | VCC | I/O | GND | VCC | I/O | I/O | VCC | 4 | 3 | 2 | GND | PWM/SERVO | I/O | I/O | VCC | VCC | GND | D12: RX D13: TX | Designed in Aizu | 10 | 9 | 8 | I/O | VCC | GND | GND | GND | GND | VCC | VCC | VCC | TX | SDA | SDA | I/O | RX | SCL | SCL | #514 | VCC | LoRa RAK811 | GND | Rev.1.0.0 A | RESET | IRF | RST | 3V3 | 5V | Vin | A0 | A1 | A2 | A3 | A4 | A5